# Altium schematic sheet Sheet2.SchDoc
size A4
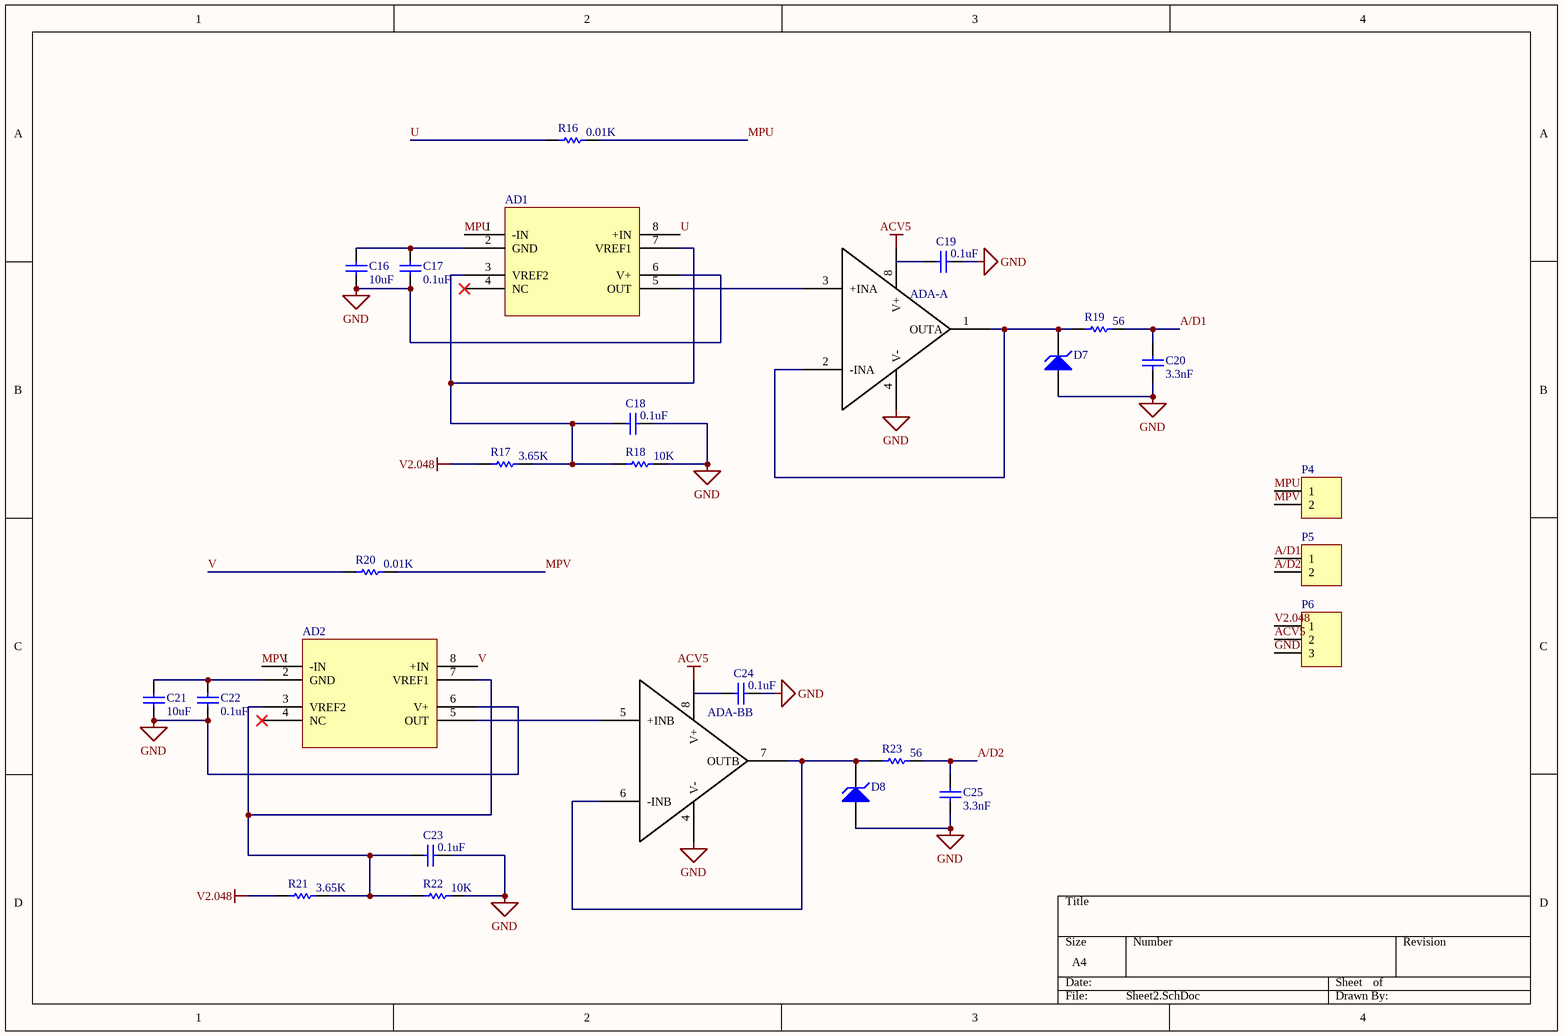
[diagram p0: Sheet2.SchDoc]

## Parts
AD1  AD8210  [AD8210]  (value not drawn)
AD2  AD8210  [AD8210]  (value not drawn)
ADA-  Component_1  [ADA4096]  (value not drawn)  (part A of 2)
ADA-B  ADA-B  [ADA4096]  (value not drawn)  (part B of 2)
C16  value 10uF  [6-0805_M]  (hidden comment: Cap)
C17  value 0.1uF  [6-0805_M]  (hidden comment: Cap)
C18  value 0.1uF  [6-0805_M]  (hidden comment: Cap)
C19  value 0.1uF  [6-0805_M]  (hidden comment: Cap)
C20  value 3.3nF  [6-0805_M]  (hidden comment: Cap)
C21  value 10uF  [6-0805_M]  (hidden comment: Cap)
C22  value 0.1uF  [6-0805_M]  (hidden comment: Cap)
C23  value 0.1uF  [6-0805_M]  (hidden comment: Cap)
C24  value 0.1uF  [6-0805_M]  (hidden comment: Cap)
C25  value 3.3nF  [6-0805_M]  (hidden comment: Cap)
D7  D Zener  [12Z-2010]  (value not drawn)
D8  D Zener  [12Z-2010]  (value not drawn)
P4  Header 2  [HDR1X2]  (value not drawn)
P5  Header 2  [HDR1X2]  (value not drawn)
P6  Header 3  [HDR1X3]  (value not drawn)
R16  value 0.01K  [6-0805_M]  (hidden comment: Res1)
R17  value 3.65K  [6-0805_M]  (hidden comment: Res1)
R18  value 10K  [6-0805_M]  (hidden comment: Res1)
R19  value 56  [6-0805_M]  (hidden comment: Res1)
R20  value 0.01K  [6-0805_M]  (hidden comment: Res1)
R21  value 3.65K  [6-0805_M]  (hidden comment: Res1)
R22  value 10K  [6-0805_M]  (hidden comment: Res1)
R23  value 56  [6-0805_M]  (hidden comment: Res1)

## Nets
ACV5: ADA-.8(V+) ADA-B.8(V+) P6.2
GND: AD1.6(V+) AD2.6(V+) ADA-.4(V-) ADA-B.4(V-) C16.1 C17.1 C18.2 C19.2 C20.1 C21.1 C22.1 C23.2 C24.2 C25.1 D7.1(A) D8.1(A) P6.3 R18.2 R22.2
V2.048: P6.1 R17.1 R21.1
A/D1: C20.2 P5.1 R19.2
A/D2: C25.2 P5.2 R23.2
MPU: AD1.1(-IN) P4.1 R16.2
MPV: AD2.1(-IN) P4.2 R20.2
U: AD1.8(+IN) R16.1
V: AD2.8(+IN) R20.1
NetAD1_2: AD1.2(GND) C16.2 C17.2
NetAD1_3: AD1.3(VREF2) AD1.7(VREF1) C18.1 R17.2 R18.1
NetAD1_5: AD1.5(OUT) ADA-.3(+INA)
NetAD2_2: AD2.2(GND) C21.2 C22.2
NetAD2_3: AD2.3(VREF2) AD2.7(VREF1) C23.1 R21.2 R22.1
NetAD2_5: AD2.5(OUT) ADA-B.5(+INB)
NetADA-_1: ADA-.1(OUTA) ADA-.2(-INA) D7.2(K) R19.1
NetADA-B_6: ADA-B.6(-INB) ADA-B.7(OUTB) D8.2(K) R23.1

Not connected (* = marked no-connect by the designer): AD1 4(NC)*; AD2 4(NC)*; C19 1; C24 1

## Library data of the parts
AD1 AD2 ADA-B = Component_1
C16-C25 = Cap: Capacitor; Published: 8-Jun-2000; LatestRevisionDate: 17-Jul-2002; LatestRevisionNote: Re-released for DXP Platform.; PackageReference: RAD-0.3; Publisher: Altium Limited; PackageDescription: Radial Cap, Thru-Hole; 2 Leads; 0.3 in Pin Spacing
D7 D8 = D Zener: Zener Diode; Published: 8-Jun-2000; LatestRevisionDate: 17-Jul-2002; LatestRevisionNote: Re-released for DXP Platform.; PackageReference: DIODE-0.7; Publisher: Altium Limited; PackageDescription: Diode, Thru-Hole; 2 Leads; 0.7 in Pin Spacing
P4 P5 = Header 2: Header, 2-Pin; LatestRevisionDate: 17-Jul-2002; LatestRevisionNote: Re-released for DXP Platform.; Publisher: Altium Limited
P6 = Header 3: Header, 3-Pin; LatestRevisionDate: 17-Jul-2002; LatestRevisionNote: Re-released for DXP Platform.; Publisher: Altium Limited
R16-R23 = Res1: Resistor; Published: 8-Jun-2000; LatestRevisionDate: 17-Jul-2002; LatestRevisionNote: Re-released for DXP Platform.; PackageReference: AXIAL-0.3; Publisher: Altium Limited; PackageDescription: Axial Device, Thru-Hole; 2 Leads; 0.3 in Pin Spacing